# EAGLE design fabmoney (EAGLE 6.1)
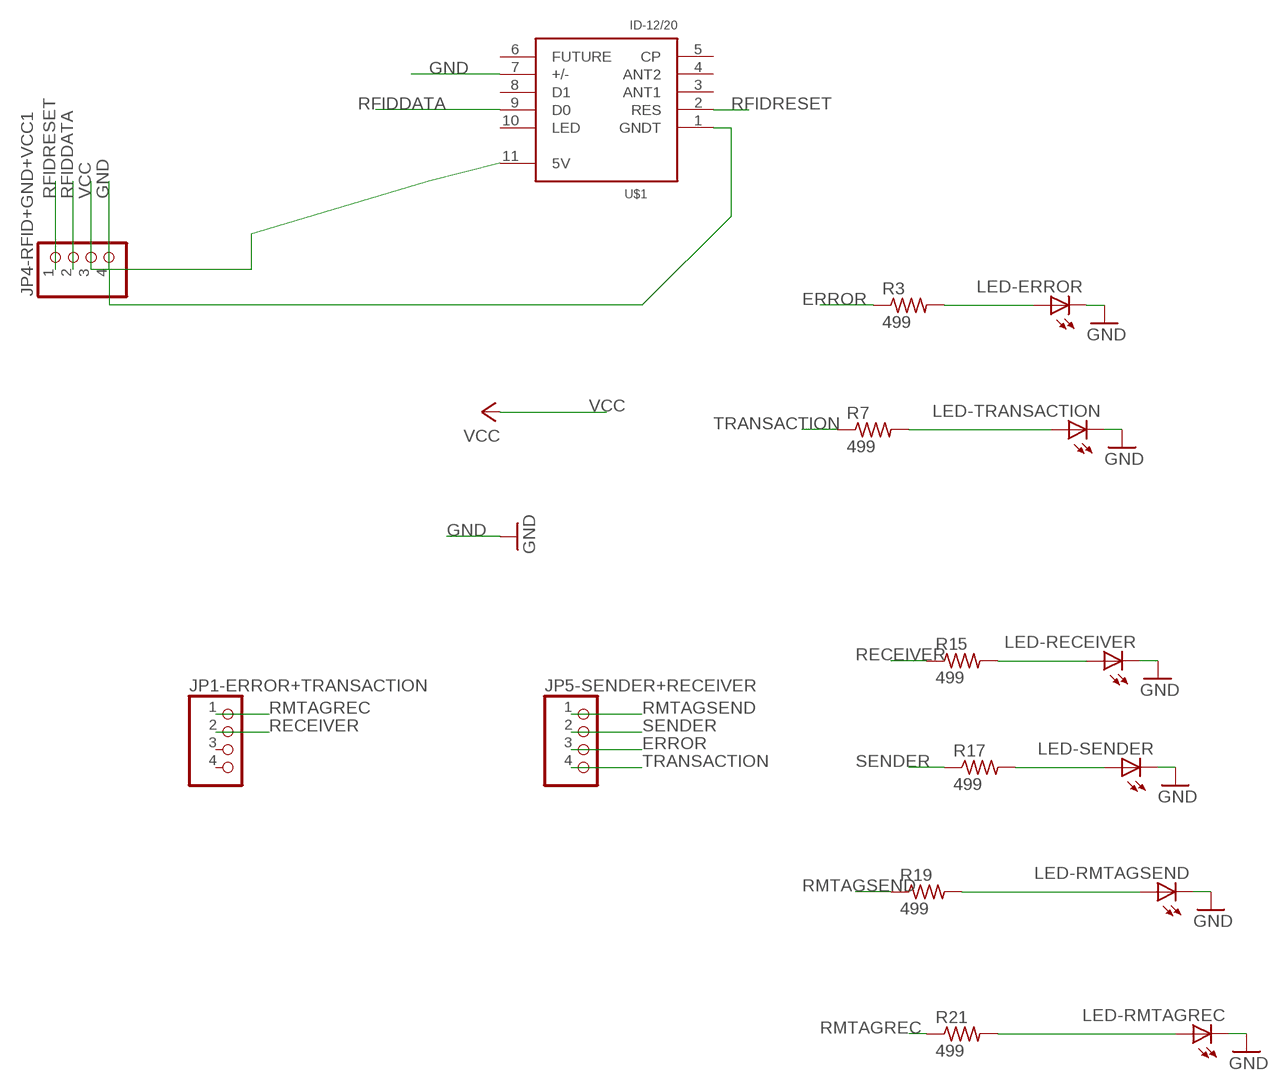
[diagram p0: schematic, sheet 1]

## Parts
JP1-ERROR+TRANSACTION  PINHD-1X4  [1X04]
JP4-RFID+GND+VCC1  PINHD-1X4  [1X04]
JP5-SENDER+RECEIVER  PINHD-1X4  [1X04]
LED-ERROR  LED5MM  [LED5MM]
LED-RECEIVER  LED5MM  [LED5MM]
LED-RMTAGREC  LED5MM  [LED5MM]
LED-RMTAGSEND  LED5MM  [LED5MM]
LED-SENDER  LED5MM  [LED5MM]
LED-TRANSACTION  LED5MM  [LED5MM]
R3  499  RESISTOR1206  [1206]
R7  499  RESISTOR1206  [1206]
R15  499  RESISTOR1206  [1206]
R17  499  RESISTOR1206  [1206]
R19  499  RESISTOR1206  [1206]
R21  499  RESISTOR1206  [1206]
U$1  ID-12/20  [ID-12]

## Nets
ERROR: JP5-SENDER+RECEIVER.3 R3.1
GND: JP4-RFID+GND+VCC1.4 LED-ERROR.K(C) LED-RECEIVER.K(C) LED-RMTAGREC.K(C) LED-RMTAGSEND.K(C) LED-SENDER.K(C) LED-TRANSACTION.K(C) U$1.1(GNDT) U$1.7(+/-)
N$16: LED-ERROR.A R3.2
N$20: LED-TRANSACTION.A R7.2
N$30: LED-RECEIVER.A R15.2
N$32: LED-SENDER.A R17.2
N$34: LED-RMTAGSEND.A R19.2
N$36: LED-RMTAGREC.A R21.2
RECEIVER: JP1-ERROR+TRANSACTION.2 R15.1
RFIDDATA: JP4-RFID+GND+VCC1.2 U$1.9(D0)
RFIDRESET: JP4-RFID+GND+VCC1.1 U$1.2(RES)
RMTAGREC: JP1-ERROR+TRANSACTION.1 R21.1
RMTAGSEND: JP5-SENDER+RECEIVER.1 R19.1
SENDER: JP5-SENDER+RECEIVER.2 R17.1
TRANSACTION: JP5-SENDER+RECEIVER.4 R7.1
VCC: JP4-RFID+GND+VCC1.3 U$1.11(5V)
Unconnected: JP1-ERROR+TRANSACTION.3 JP1-ERROR+TRANSACTION.4 U$1.3(ANT1) U$1.4(ANT2) U$1.5(CP) U$1.6(FUTURE) U$1.8(D1) U$1.10(LED)

## Library data of the parts
JP1-ERROR+TRANSACTION JP4-RFID+GND+VCC1 JP5-SENDER+RECEIVER = pinhead:PINHD-1X4: PIN HEADER
LED-ERROR LED-RECEIVER LED-RMTAGREC LED-RMTAGSEND LED-SENDER LED-TRANSACTION = 01_adafruit:LED: LED OSRAM: - CHIPLED LG R971, LG N971, LY N971, LG Q971, LY Q971, LO R971, LY R971 LH N974, LH R974 LS Q976, LO Q976, LY Q976 LO Q996 - Hyper CHIPLED LW Q18S LB Q993, LB Q99A, LB R99A - SideLED LS A670, LO A670, LY A670, LG A670, LP A670 LB A673, LV A673, LT A673, LW A673 LH A674 LY A675 LS A676, LA A676, LO A676, LY A676, LW A676 LS A679, LY A679, LG A679 - Hyper Micro SIDELED® LS Y876, LA Y876, LO Y876, LY Y876 LT Y87S - SmartLED LW L88C, LW L88S LB L89C, LB L89S, LG L890 LS L89K, LO L89K, LY L89K LS L896, LA L896, LO L896, LY L896 - TOPLED LS T670, LO T670, LY T670, LG T670, LP T670 LSG T670, LSP T670, LSY T670, LOP T670, LYG T670 LG T671, LOG T671, LSG T671 LB T673, LV T673, LT T673, LW T673 LH T674 LS T676, LA T676, LO T676, LY T676, LB T676, LH T676, LSB T676, LW T676 LB T67C, LV T67C, LT T67C, LS T67K, LO T67K, LY T67K, LW E67C LS E67B, LA E67B, LO E67B, LY E67B, LB E67C, LV E67C, LT E67C LW T67C LS T679, LY T679, LG T679 LS T770, LO T770, LY T770, LG T770, LP T770 LB T773, LV T773, LT T773, LW T773 LH T774 LS E675, LA E675, LY E675, LS T675 LS T776, LA T776, LO T776, LY T776, LB T776 LHGB T686 LT T68C, LB T68C - Hyper Mini TOPLED® LB M676 - Mini TOPLED Santana® LG M470 LS M47K, LO M47K, LY M47K Source: http://www.osram.convergy.de/
R3 R7 R15 R17 R19 R21 = ng:RESISTOR
U$1 = SparkFun:ID-12/20: ID2, ID12, and ID20 Package

## Board
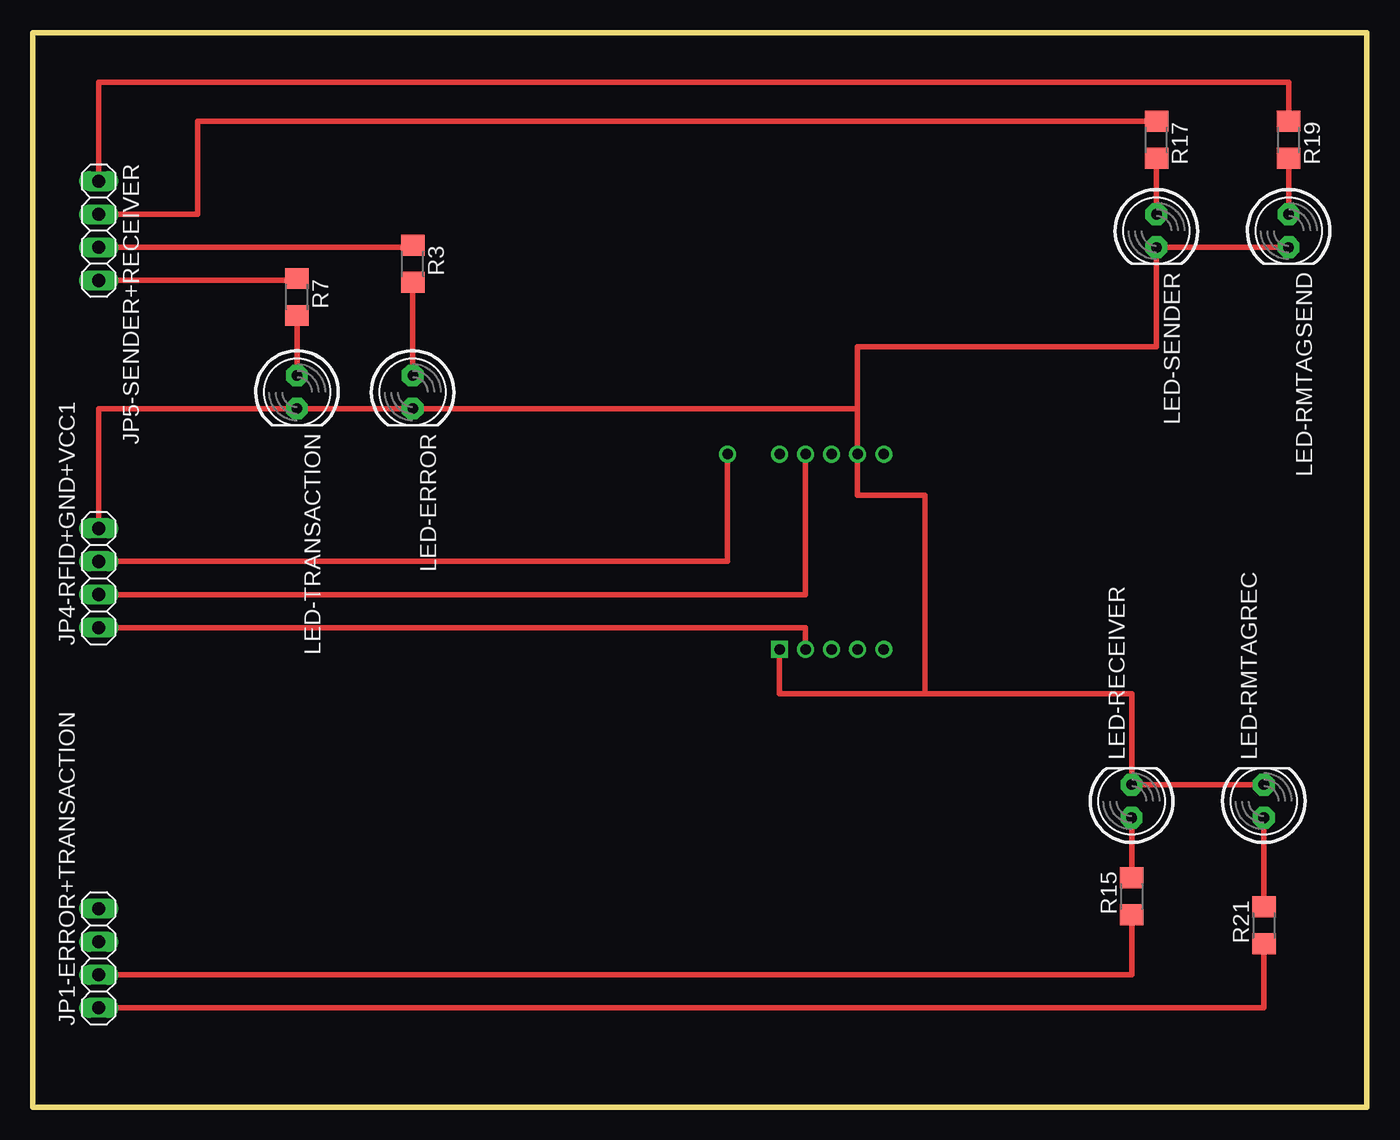
[diagram p1: board, top side]

Size 102.54 x 82.54 mm. Coordinates in mm from the lower left corner, seen from the top.
Outline: 0,0 102.54,0 102.54,82.54 0,82.54 0,0
Copper layers (1*16): Top 0.035mm / dielectric 1.5mm / Bottom 0.035mm
Design rules: minimum track width 12mil, minimum drill 0.4mm, track to track 0.4mm, track to pad 0.4mm, pad to pad 0.4mm, via to via 0.4mm, smd to smd 0mil, copper to edge 0.000025mm, drill to drill 8mil, minimum pad ring 10mil, minimum via ring 8mil, stop-mask expansion 4mil, vias tented up to drill 0mil, thermal gap 10mil

### Footprints (pad centres in the part's own frame; a part is rotated, then mirrored left to right if it is on the bottom)
1X04 = drill 1.016 long: 1 -3.81,0; 2 -1.27,0; 3 1.27,0; 4 3.81,0
LED5MM = drill 0.813 pad 1.676 octagon: A -1.27,0; K 1.27,0
1206 = smd 1.6 x 1.803: 1 -1.422,0; 2 1.422,0
ID-12 = drill 0.8 square: 1 16.255,5.32 | drill 0.8: 2 14.255,5.32; 3 12.255,5.32; 4 10.255,5.32; 5 8.255,5.32; 6 8.255,20.32; 7 10.255,20.32; 8 12.255,20.32; 9 14.255,20.32; 10 16.255,20.32; 11 20.255,20.32

### Placement (x,y rotation side)
JP1-ERROR+TRANSACTION  5.08,11.43 90 top
JP4-RFID+GND+VCC1  5.08,40.64 90 top
JP5-SENDER+RECEIVER  5.08,67.31 270 top
LED-ERROR  29.21,54.93 270 top
LED-RECEIVER  84.45,23.5 90 top
LED-RMTAGREC  94.61,23.5 90 top
LED-RMTAGSEND  96.52,67.31 270 top
LED-SENDER  86.36,67.31 270 top
LED-TRANSACTION  20.32,54.93 270 top
R3  29.21,64.77 270 top
R7  20.32,62.23 270 top
R15  84.45,16.19 90 top
R17  86.36,74.3 270 top
R19  96.52,74.3 270 top
R21  94.61,13.97 90 top
U$1  73.66,29.84 0 bottom

### Tracks (layer width: path | path; a pad name or v marks a point on that pad's centre or on a via)
ERROR
  Top 0.406: JP5-SENDER+RECEIVER.3 29.21,66.04 R3.1
GND
  Top 0.406: 68.58,31.75 68.58,46.99 63.41,46.99 U$1.7 63.41,53.66 | U$1.1 57.41,31.75 68.58,31.75 | 63.41,53.66 63.41,58.42 86.36,58.42 LED-SENDER.K LED-RMTAGSEND.K | LED-RMTAGREC.K LED-RECEIVER.K 84.45,31.75 68.58,31.75 | 63.41,53.66 LED-ERROR.K LED-TRANSACTION.K 5.08,53.66 JP4-RFID+GND+VCC1.4
N$16
  Top 0.406: R3.2 LED-ERROR.A
N$20
  Top 0.406: R7.2 LED-TRANSACTION.A
N$30
  Top 0.406: R15.2 LED-RECEIVER.A
N$32
  Top 0.406: R17.2 LED-SENDER.A
N$34
  Top 0.406: R19.2 LED-RMTAGSEND.A
N$36
  Top 0.406: R21.2 LED-RMTAGREC.A
RECEIVER
  Top 0.406: R15.1 84.45,10.16 JP1-ERROR+TRANSACTION.2
RFIDDATA
  Top 0.406: U$1.9 59.41,39.37 JP4-RFID+GND+VCC1.2
RFIDRESET
  Top 0.406: U$1.2 59.41,36.83 JP4-RFID+GND+VCC1.1
RMTAGREC
  Top 0.406: R21.1 94.61,7.62 JP1-ERROR+TRANSACTION.1
RMTAGSEND
  Top 0.406: JP5-SENDER+RECEIVER.1 5.08,78.74 96.52,78.74 R19.1
SENDER
  Top 0.406: R17.1 12.7,75.72 12.7,68.58 JP5-SENDER+RECEIVER.2
TRANSACTION
  Top 0.406: JP5-SENDER+RECEIVER.4 20.32,63.5 R7.1
VCC
  Top 0.406: JP4-RFID+GND+VCC1.3 53.41,41.91 U$1.11
(copper drawn outside any net)
  shapes: Top area x1